# Altium project BEAGLEBONEBLACK.PrjPcb (part 5 of 6)

## Sheet BoardID.SchDoc
size Letter
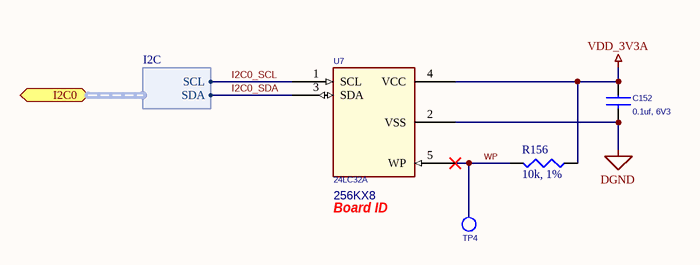
[diagram p17: BoardID.SchDoc]

### Parts
C152  0.1uf, 6V3  [402]
R156  10k, 1%  [402]
TP4  TESTPT1  [tp1-8040]  (value not drawn)  (no BOM)
U7  24LC32A  [SOT23-5]

### Ports
I2C0 (harness I2C)

### Harnesses
I2C: SDA, SCL

### Nets
DGND: C152.2 U7.2(VSS)
VDD_3V3A: C152.1 R156.1 U7.4(VCC)
I2C0_SCL: U7.1(SCL) ; port I2C0.SCL
I2C0_SDA: U7.3(SDA) ; port I2C0.SDA
WP: R156.2 TP4.1(TP) U7.5(WP)

### Notes on the sheet
- (near U7) 256KX8
- (near U7) Board ID

### Library data of the parts
C152 = CAP_0.1uF_X7R_16V_10% 0402: as C27-C30 on sheet P03_Processor 1 of 3, JTAG Header; Supplier 1: Digi-Key; Supplier Part Number 1: 445-1266-6-ND; RoHS: RoHS Compliant; Category: Capacitors; Stock 1: 127094; Pricing 1: 1=0.1, 10=0.026, 100=0.0121, 250=0.00992, 500=0.00848, 1000=0.0066, 5000=0.0055 (USD); Voltage - Rated: 6.3V; Tolerance: ±10%; Temperature Coefficient: X5R; Mounting Type: Surface Mount, MLCC; Operating Temperature: -55°C ~ 85°C; Applications: General Purpose; Ratings: -; Package / Case: 0402 (1005 Metric); Size / Dimension: 0.039" L x 0.020" W (1.00mm x 0.50mm); Height - Seated (Max): -; Thickness (Max): 0.022" (0.55mm); Lead Spacing: -; Features: -; Packaging: Digi-Reel®; Lead Style: -; ComponentLink1URL: http://product.tdk.com/capacitor/mlcc/en/documents/mlcc_commercial_general_en.pdf; ComponentLink1Description: http://product.tdk.com/capacitor/mlcc/en/documents/mlcc_commercial_general_en.pdf
R156 = RES_10K_1/16W_1%_0402: as R14 on sheet P03_Processor 1 of 3, JTAG Header; Category: Resistors; ComponentLink1Description: http://rohmfs.rohm.com/en/products/databook/datasheet/passive/resistor/chip_resistor/mcr_a.pdf; ComponentLink1URL: http://rohmfs.rohm.com/en/products/databook/datasheet/passive/resistor/chip_resistor/mcr_a.pdf; Composition: Thick Film; Features: Automotive AEC-Q200 Qualified; Height: 0.016" (0.40mm); Number of Terminations: 2; Package / Case: 0402 (1005 Metric); Packaging: Digi-Reel®; Pricing 1: 1=0.1, 10=0.019, 25=0.014, 100=0.0078, 250=0.00596, 500=0.00476, 1000=0.0035, 5000=0.00251 (USD); Resistance (Ohms): 10k; RoHS: RoHS Compliant; Size / Dimension: 0.039" L x 0.020" W (1.00mm x 0.50mm); Stock 1: 110842; Supplier 1: Digi-Key; Supplier Device Package: 0402 (1005 Metric); Supplier Part Number 1: RHM10KJDKR-ND; Tolerance: ±5%
U7 = 24LC32A: IC EEPROM 32KBIT 400KHZ SOT23-5; Manufacturer: Microchip Technology; Manufacturer Part Number: 24LC32AT-I/OT; Format - Memory: EEPROMs - Serial; Memory Size: 32K (4K x 8); Interface: I²C, 2-Wire Serial; Voltage - Supply: 2.5 V ~ 5.5 V; Supplier 1: Digi-Key; Supplier Part Number 1: 24LC32AT-I/OTDKR-ND; RoHS: RoHS Compliant; Category: Integrated Circuits (ICs); Stock 1: 8694; Pricing 1: 1=0.5, 10=0.32, 25=0.31, 100=0.3 (USD); Memory Type: EEPROM; Speed: 400kHz; Operating Temperature: -40°C ~ 85°C; Package / Case: SC-74A, SOT-753; Supplier Device Package: SOT-23-5; Packaging: Digi-Reel®; ComponentLink1URL: http://ww1.microchip.com/downloads/en/DeviceDoc/21713M.pdf; ComponentLink1Description: http://ww1.microchip.com/downloads/en/DeviceDoc/21713M.pdf

## Sheet USB_PC.SchDoc
size Letter
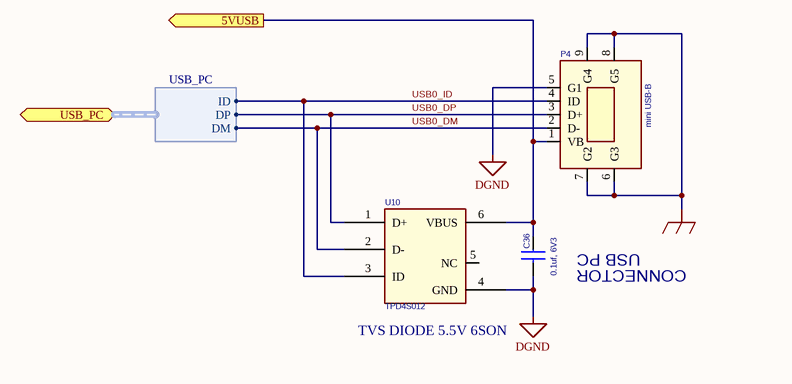
[diagram p18: USB_PC.SchDoc]

### Parts
C36  0.1uf, 6V3  [402]
P4  mini USB-B  [USB5MINI_4SHIELDED_SMD-5]
U10  TPD4S012  [U_6_DRY]

### Ports
5VUSB (out), USB_PC (harness USB_PC)

### Harnesses
USB_PC: ID, DP, DM

### Nets
DGND: C36.2 P4.5(G1) U10.4(GND)
GND_EARTH: P4.6(G3) P4.7(G2) P4.8(G5) P4.9(G4)
USB0_DM: P4.2(D-) U10.2(D-) ; port USB_PC.DM
USB0_DP: P4.3(D+) U10.1(D+) ; port USB_PC.DP
USB0_ID: P4.4(ID) U10.3(ID) ; port USB_PC.ID
NetC1_2: C36.1 P4.1(VB) U10.6(VBUS) ; port 5VUSB

Not connected (* = marked no-connect by the designer): U10 5(NC)

### Notes on the sheet
- USB PC
- CONNECTOR
- (near U10) TVS DIODE 5.5V 6SON

### Library data of the parts
C36 = CAP_0.1uF_X7R_16V_10% 0402: as C27-C30 on sheet P03_Processor 1 of 3, JTAG Header; Supplier 1: Digi-Key; Supplier Part Number 1: 445-1266-6-ND; RoHS: RoHS Compliant; Category: Capacitors; Stock 1: 127604; Pricing 1: 1=0.1, 10=0.026, 100=0.0121, 250=0.00992, 500=0.00848, 1000=0.0066, 5000=0.0055 (USD); Voltage - Rated: 6.3V; Tolerance: ±10%; Temperature Coefficient: X5R; Mounting Type: Surface Mount, MLCC; Operating Temperature: -55°C ~ 85°C; Applications: General Purpose; Ratings: -; Package / Case: 0402 (1005 Metric); Size / Dimension: 0.039" L x 0.020" W (1.00mm x 0.50mm); Height - Seated (Max): -; Thickness (Max): 0.022" (0.55mm); Lead Spacing: -; Features: -; Packaging: Digi-Reel®; Lead Style: -; ComponentLink1URL: http://product.tdk.com/capacitor/mlcc/en/documents/mlcc_commercial_general_en.pdf; ComponentLink1Description: http://product.tdk.com/capacitor/mlcc/en/documents/mlcc_commercial_general_en.pdf
P4 = MINI-USB-AB-SOCKET: CONN RCPT USB MINI B R/A SMD; Manufacturer: KYCON; Manufacturer Part Number: 0565790576; Order# 2: C-440247; ATLStockNo1: 4500.0223; Order#: KMAB-SMT-5S-S-30TR; Connector Type: USB - mini AB; Number of Contacts: 5; Gender: Receptacle; Specifications: USB 2.0 OTG; Manufacturer 2: AMP; Distributor: Deltron; Distributor 2: Tyco; Supplier 1: Digi-Key; Supplier Part Number 1: WM17122DKR-ND; RoHS: RoHS Compliant; Category: Connectors, Interconnects; Stock 1: 12426; Pricing 1: 1=2.92, 10=2.649, 25=2.4872, 50=2.3792, 100=2.271, 250=2.05468 (USD); Mounting Type: Surface Mount, Right Angle, Horizontal; Features: Shielded; Packaging: Digi-Reel®; Ingress Protection: -; ComponentLink1URL: http://www.molex.com/pdm_docs/sd/565790576_sd.pdf; ComponentLink1Description: http://www.molex.com/pdm_docs/sd/565790576_sd.pdf
U10 = PROT_TPD4S012: ESD 4channel USB Interface; Mfr: TI; MfrNum: TPD4S012DRY; TIIntPartnumber: 1A0233; Manufacturer: Texas Instruments; Manufacturer Part Number: TPD4S012DRYR; Vendor: Digikey; Cost100: 0.76; Cost10K: 0.23; Power (Watts): 60W; Number of Circuits: 4; PartName: TPD4S012; Supplier 1: Digi-Key; Supplier Part Number 1: 296-24244-6-ND; RoHS: RoHS Compliant; Category: Circuit Protection; Stock 1: 7978; Pricing 1: 1=0.78, 10=0.682, 25=0.6028, 100=0.2552, 250=0.25044, 500=0.2457, 750=0.24097 (USD); Voltage - Working: -; Voltage - Clamping: -; Technology: Mixed Technology; Applications: USB; Package / Case: 6-UFDFN; Supplier Device Package: 6-SON (1.45x1); Packaging: Digi-Reel®; ComponentLink1URL: http://www.ti.com/lit/ds/symlink/tpd4s012.pdf; ComponentLink1Description: http://www.ti.com/lit/ds/symlink/tpd4s012.pdf